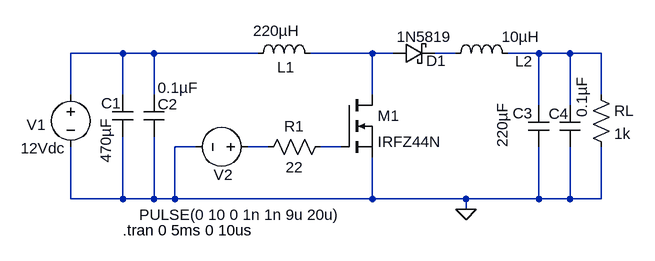
[diagram p0: schematic boost_with_FB.asc]
boost_with_FB.asc, the LTspice schematic file:
Version 4.1
SHEET 1 880 680
WIRE -128 64 -208 64
WIRE -80 64 -128 64
WIRE 80 64 -80 64
WIRE 256 64 160 64
WIRE 288 64 256 64
WIRE 384 64 352 64
WIRE 512 64 464 64
WIRE 560 64 512 64
WIRE 608 64 560 64
WIRE -208 128 -208 64
WIRE -128 128 -128 64
WIRE -80 128 -80 64
WIRE 256 128 256 64
WIRE 608 128 608 64
WIRE 512 144 512 64
WIRE 560 144 560 64
WIRE -16 208 -48 208
WIRE 96 208 64 208
WIRE 208 208 176 208
WIRE -208 288 -208 208
WIRE -128 288 -128 192
WIRE -128 288 -208 288
WIRE -80 288 -80 192
WIRE -80 288 -128 288
WIRE -48 288 -48 208
WIRE -48 288 -80 288
WIRE 256 288 256 224
WIRE 256 288 -48 288
WIRE 400 288 256 288
WIRE 512 288 512 208
WIRE 512 288 400 288
WIRE 560 288 560 208
WIRE 560 288 512 288
WIRE 608 288 608 208
WIRE 608 288 560 288
WIRE 400 304 400 288
FLAG 400 304 0
SYMBOL voltage -208 112 R0
WINDOW 0 -68 62 Left 2
WINDOW 3 -77 98 Left 2
WINDOW 123 0 0 Left 0
WINDOW 39 0 0 Left 0
SYMATTR InstName V1
SYMATTR Value 12Vdc
SYMBOL cap -144 128 R0
WINDOW 0 -17 13 Left 2
WINDOW 3 -10 36 VRight 2
SYMATTR InstName C1
SYMATTR Value 470µF
SYMBOL cap -96 128 R0
WINDOW 0 22 14 Left 2
WINDOW 3 22 -11 Left 2
SYMATTR InstName C2
SYMATTR Value 0.1µF
SYMBOL ind 64 80 R270
WINDOW 0 -21 59 VTop 2
WINDOW 3 66 44 VBottom 2
SYMATTR InstName L1
SYMATTR Value 220µH
SYMATTR SpiceLine Rser=0.1
SYMBOL schottky 288 80 R270
WINDOW 0 -11 66 VTop 2
WINDOW 3 57 48 VBottom 2
SYMATTR InstName D1
SYMATTR Value 1N5819
SYMBOL voltage 80 208 R90
WINDOW 0 43 39 VRight 2
WINDOW 3 104 -128 VRight 2
WINDOW 123 0 0 Left 0
WINDOW 39 0 0 Left 0
SYMATTR InstName V2
SYMATTR Value PULSE(0 10 0 1n 1n 9u 20u)
SYMBOL cap 496 144 R0
WINDOW 0 -24 12 Left 2
WINDOW 3 -40 -4 VRight 2
SYMATTR InstName C3
SYMATTR Value 220µF
SYMBOL cap 544 144 R0
WINDOW 0 -17 13 Left 2
WINDOW 3 34 19 VLeft 2
SYMATTR InstName C4
SYMATTR Value 0.1µF
SYMBOL ind 368 80 R270
WINDOW 0 -12 121 VTop 2
WINDOW 3 57 116 VBottom 2
SYMATTR InstName L2
SYMATTR Value 10µH
SYMATTR SpiceLine Rser=0.1
SYMBOL res 592 112 R0
SYMATTR InstName RL
SYMATTR Value 1k
SYMBOL nmos 208 128 R0
SYMATTR InstName M1
SYMATTR Value IRFZ44N
SYMBOL res 192 192 R90
WINDOW 0 0 56 VBottom 2
WINDOW 3 32 56 VTop 2
SYMATTR InstName R1
SYMATTR Value 22
TEXT -128 336 Left 2 !.tran 0 5ms 0 10us

The netlist it stands for:
* boost_with_FB.asc
V1 N001 0 12Vdc
C1 N001 0 470µF
C2 N001 0 0.1µF
L1 N001 N002 220µH Rser=0.1
D1 N002 N003 1N5819
V2 N005 0 PULSE(0 10 0 1n 1n 9u 20u)
C3 N004 0 220µF
C4 N004 0 0.1µF
L2 N003 N004 10µH Rser=0.1
RL N004 0 1k
M1 N002 N006 0 0 IRFZ44N
R1 N006 N005 22
.model D D
.lib standard.dio
.model NMOS NMOS
.model PMOS PMOS
.lib standard.mos
.tran 0 5ms 0 10us
.backanno
.end